# Altium schematic sheet Sheet1.SchDoc: GasCheck
size A; SheetNumber: 1; SheetTotal: 1; SPICEModelCacheGRZXFTUM: <root> / <DocumentId>GRZXFTUM</DocumentId> / <CacheFrame Number="0"> / <Model Name="cap" Kind="MDL"> / <Text>*Default semiconductor capacitor / .MODEL CAP C()</Text> / </Model> / </CacheFrame> / </root>
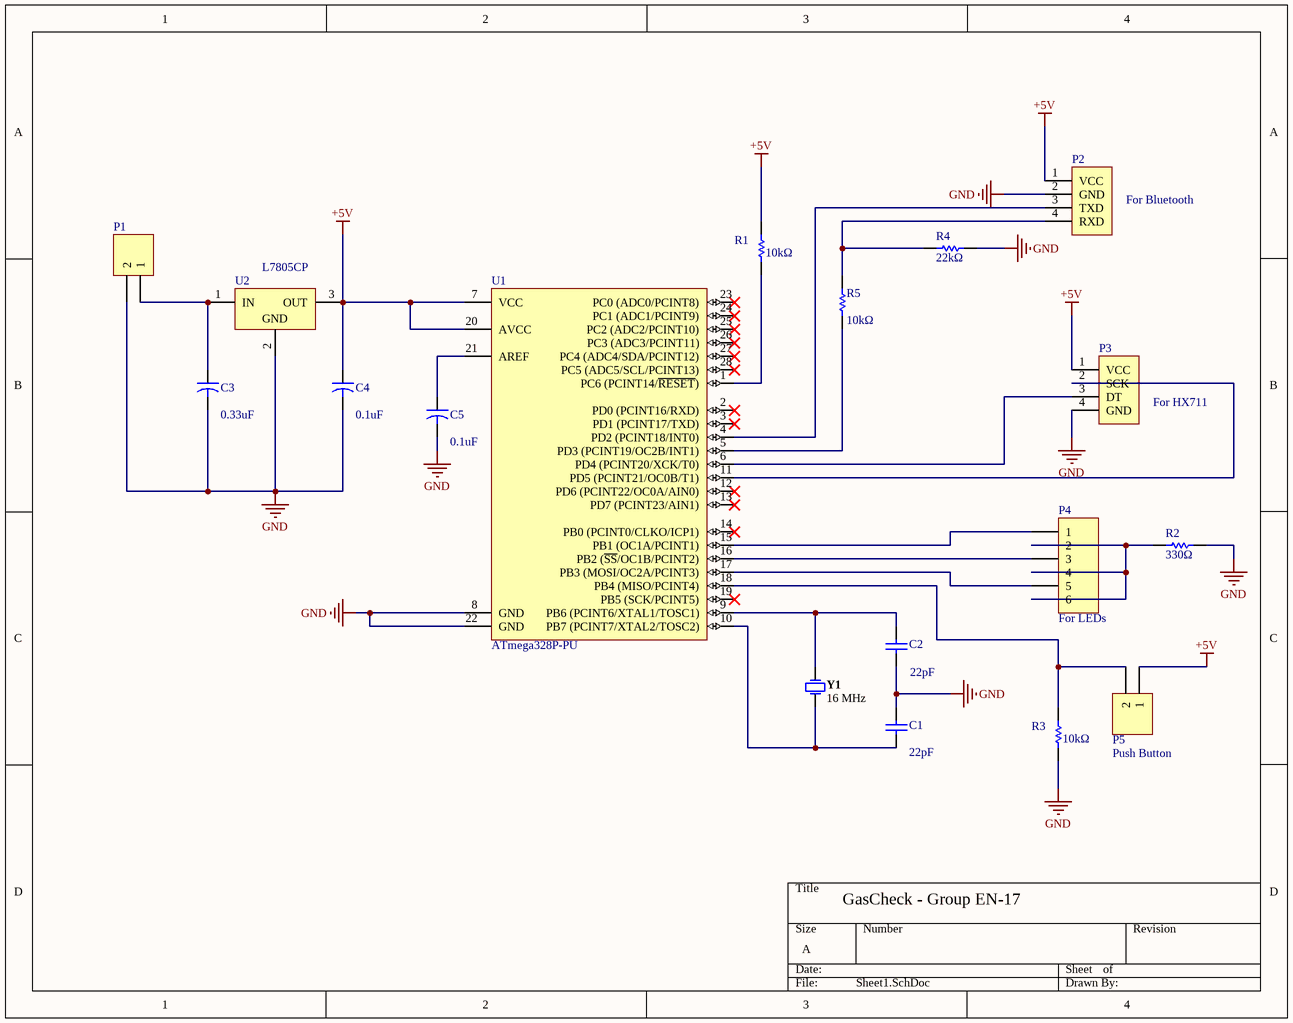
[diagram p0: Sheet1.SchDoc]

## Parts
C1  value 22pF  [RAD-0.3]  (hidden comment: Cap)
C2  value 22pF  [RAD-0.3]  (hidden comment: Cap)
C3  value 0.33uF  [CAPR5-4X5]  (hidden comment: Cap2)
C4  value 0.1uF  [CAPR5-4X5]  (hidden comment: Cap2)
C5  value 0.1uF  [CAPR5-4X5]  (hidden comment: Cap2)
P1  Connector  [HDR1X2]  (value not drawn)
P2  For Bluetooth  [HDR1X4]
P3  For HX711  [HDR1X4]
P4  For LEDs  [HDR1X6]
P5  Push Button  [HDR1X2]
R1  value 10kΩ  [AXIAL-0.3]  (hidden comment: Res1)
R2  value 330Ω  [AXIAL-0.3]  (hidden comment: Res1)
R3  value 10kΩ  [AXIAL-0.3]  (hidden comment: Res1)
R4  value 22kΩ  [AXIAL-0.3]  (hidden comment: Res1)
R5  value 10kΩ  [AXIAL-0.3]  (hidden comment: Res1)
U1  ATmega328P-PU  [28P3]
U2  L7805CP  [TO220FP]
Y1  16 MHz  [FOX-FOXSLF160-20]

## Nets
+5V: C4.1 P2.1(VCC) P3.1(VCC) P5.1 R1.1 U1.7(VCC) U1.20(AVCC) U2.3(OUT)
GND: C1.2 C2.2 C3.2 C4.2 C5.2 P1.2 P2.2(GND) P3.4(GND) R2.2 R3.2 R4.2 U1.8(GND) U1.22(GND) U2.2(GND)
NetC1_1: C1.1 U1.10(PB7_(PCINT7/XTAL2/TOSC2)) Y1.2
NetC2_1: C2.1 U1.9(PB6_(PCINT6/XTAL1/TOSC1)) Y1.1
NetC3_1: C3.1 P1.1 U2.1(IN)
NetC5_1: C5.1 U1.21(AREF)
NetP2_3: P2.3(TXD) U1.4(PD2_(PCINT18/INT0))
NetP2_4: P2.4(RXD) R4.1 R5.2
NetP3_2: P3.2(SCK) U1.11(PD5_(PCINT21/OC0B/T1))
NetP3_3: P3.3(DT) U1.6(PD4_(PCINT20/XCK/T0))
NetP4_1: P4.1 U1.15(PB1_(OC1A/PCINT1))
NetP4_2: P4.2 P4.4 P4.6 R2.1
NetP4_3: P4.3 U1.16(PB2_(~{SS}/OC1B/PCINT2))
NetP4_5: P4.5 U1.17(PB3_(MOSI/OC2A/PCINT3))
NetP5_2: P5.2 R3.1 U1.18(PB4_(MISO/PCINT4))
NetR1_2: R1.2 U1.1(PC6_(PCINT14/~{RESET}))
NetR5_1: R5.1 U1.5(PD3_(PCINT19/OC2B/INT1))

Not connected (* = marked no-connect by the designer): U1 2(PD0_(PCINT16/RXD))* 3(PD1_(PCINT17/TXD))* 12(PD6_(PCINT22/OC0A/AIN0))* 13(PD7_(PCINT23/AIN1))* 14(PB0_(PCINT0/CLKO/ICP1))* 19(PB5_(SCK/PCINT5))* 23(PC0_(ADC0/PCINT8))* 24(PC1_(ADC1/PCINT9))* 25(PC2_(ADC2/PCINT10))* 26(PC3_(ADC3/PCINT11))* 27(PC4_(ADC4/SDA/PCINT12))* 28(PC5_(ADC5/SCL/PCINT13))*

## Notes on the sheet
- GasCheck - Group EN-17

## Library data of the parts
C1 C2 = Cap: Capacitor; Published: 8-Jun-2000; LatestRevisionDate: 17-Jul-2002; LatestRevisionNote: Re-released for DXP Platform.; PackageReference: RAD-0.3; Publisher: Altium Limited; PackageDescription: Radial Cap, Thru-Hole; 2 Leads; 0.3 in Pin Spacing
C3-C5 = Cap2: Capacitor; Published: 23-Sep-2002; PackageReference: CAPR5-4X5; Publisher: Altium Limited; PackageDescription: Capacitor; 2 Leads
P1 P5 = Header 2: Header, 2-Pin; LatestRevisionDate: 17-Jul-2002; LatestRevisionNote: Re-released for DXP Platform.; Publisher: Altium Limited
P2 P3 = Header 4: Header, 4-Pin; LatestRevisionDate: 17-Jul-2002; LatestRevisionNote: Re-released for DXP Platform.; Publisher: Altium Limited
P4 = Header 6: Header, 6-Pin; LatestRevisionDate: 17-Jul-2002; LatestRevisionNote: Re-released for DXP Platform.; Publisher: Altium Limited
R1-R5 = Res1: Resistor; Published: 8-Jun-2000; LatestRevisionDate: 17-Jul-2002; LatestRevisionNote: Re-released for DXP Platform.; PackageReference: AXIAL-0.3; Publisher: Altium Limited; PackageDescription: Axial Device, Thru-Hole; 2 Leads; 0.3 in Pin Spacing
U1 = CMP-0095-00013-2: 8-bit AVR Microcontroller, 32KB Flash, 1KB EEPROM, 2KB SRAM, 28-pin PDIP, Industrial Grade (-40°C to 85°C); RevisionNote: DatasheetVersion updated. URLs added.; PackageVersion: revB, Sep-2001; PackageDescription: 28-lead (0.300"/7.62mm Wide) Plastic Dual Inline Package (PDIP); DatasheetVersion: revD, May-2011; ComponentLink1Description: Manufacturer URL; ComponentLink1URL: http://www.atmel.com/; PackageReference: 28P3; ComponentLink2Description: ATmega48A/48PA/88A/88PA/168A/168PA/328/328P Datasheet; ComponentLink3URL: http://www.atmel.com/dyn/resources/prod_documents/8271S.pdf; ComponentLink2URL: http://www.atmel.com/dyn/resources/prod_documents/8271.pdf; ComponentLink3Description: ATmega48A/48PA/88A/88PA/168A/168PA/328/328P Summary
U2 = CMP-0244-00474-1: Positive Voltage Regulator, 5V, 3-Pin TO-220FP; ComponentLink1Description: Manufacturer URL; ComponentLink2Description: Datasheet; DatasheetVersion: 16/11/2011; PackageDescription: TO, Thru-Hole, Vertical, Heatsink Mounted; 3 In-Line Leads; Pitch 2.54 mm; ComponentLink2URL: http://www.st.com/internet/com/TECHNICAL_RESOURCES/TECHNICAL_LITERATURE/DATASHEET/CD00000444.pdf; ComponentLink1URL: http://www.st.com; PackageVersion: 2011; PackageReference: TO220FP
Y1 = CMP-1749-00003-1: Resistance Weld Thru-Hole Crystal, 16 MHz, -20 to 70 degC, 2-Pin THD, RoHS, Bulk; Voltage Rating: 250 V; Tolerance: 1%; Resistance: 221 kohm; Case\Package: Axial; Power Rating: 250 mW; RoHSCompliant: true; Package Quantity: 200; Packaging: Bulk; Min Operating Temperature: -55 degC; DatasheetVersion: Mar-15; ComponentLink1URL: http://www.foxonline.com/; Max Operating Temperature: 155 degC; PackageReference: FOXSLF160-20; Mount: Through Hole; PackageDescription: 2-Pin Through Hole Device, Body 11.35 x 4.65 mm; ComponentLink1Description: Manufacturer URL; ComponentLink2URL: http://www.foxonline.com/pdfs/hc49slf.pdf; ComponentLink2Description: Datasheet; Length: 0.248 inch